# Altium schematic sheet main.SchDoc
size 594 x 420 mm
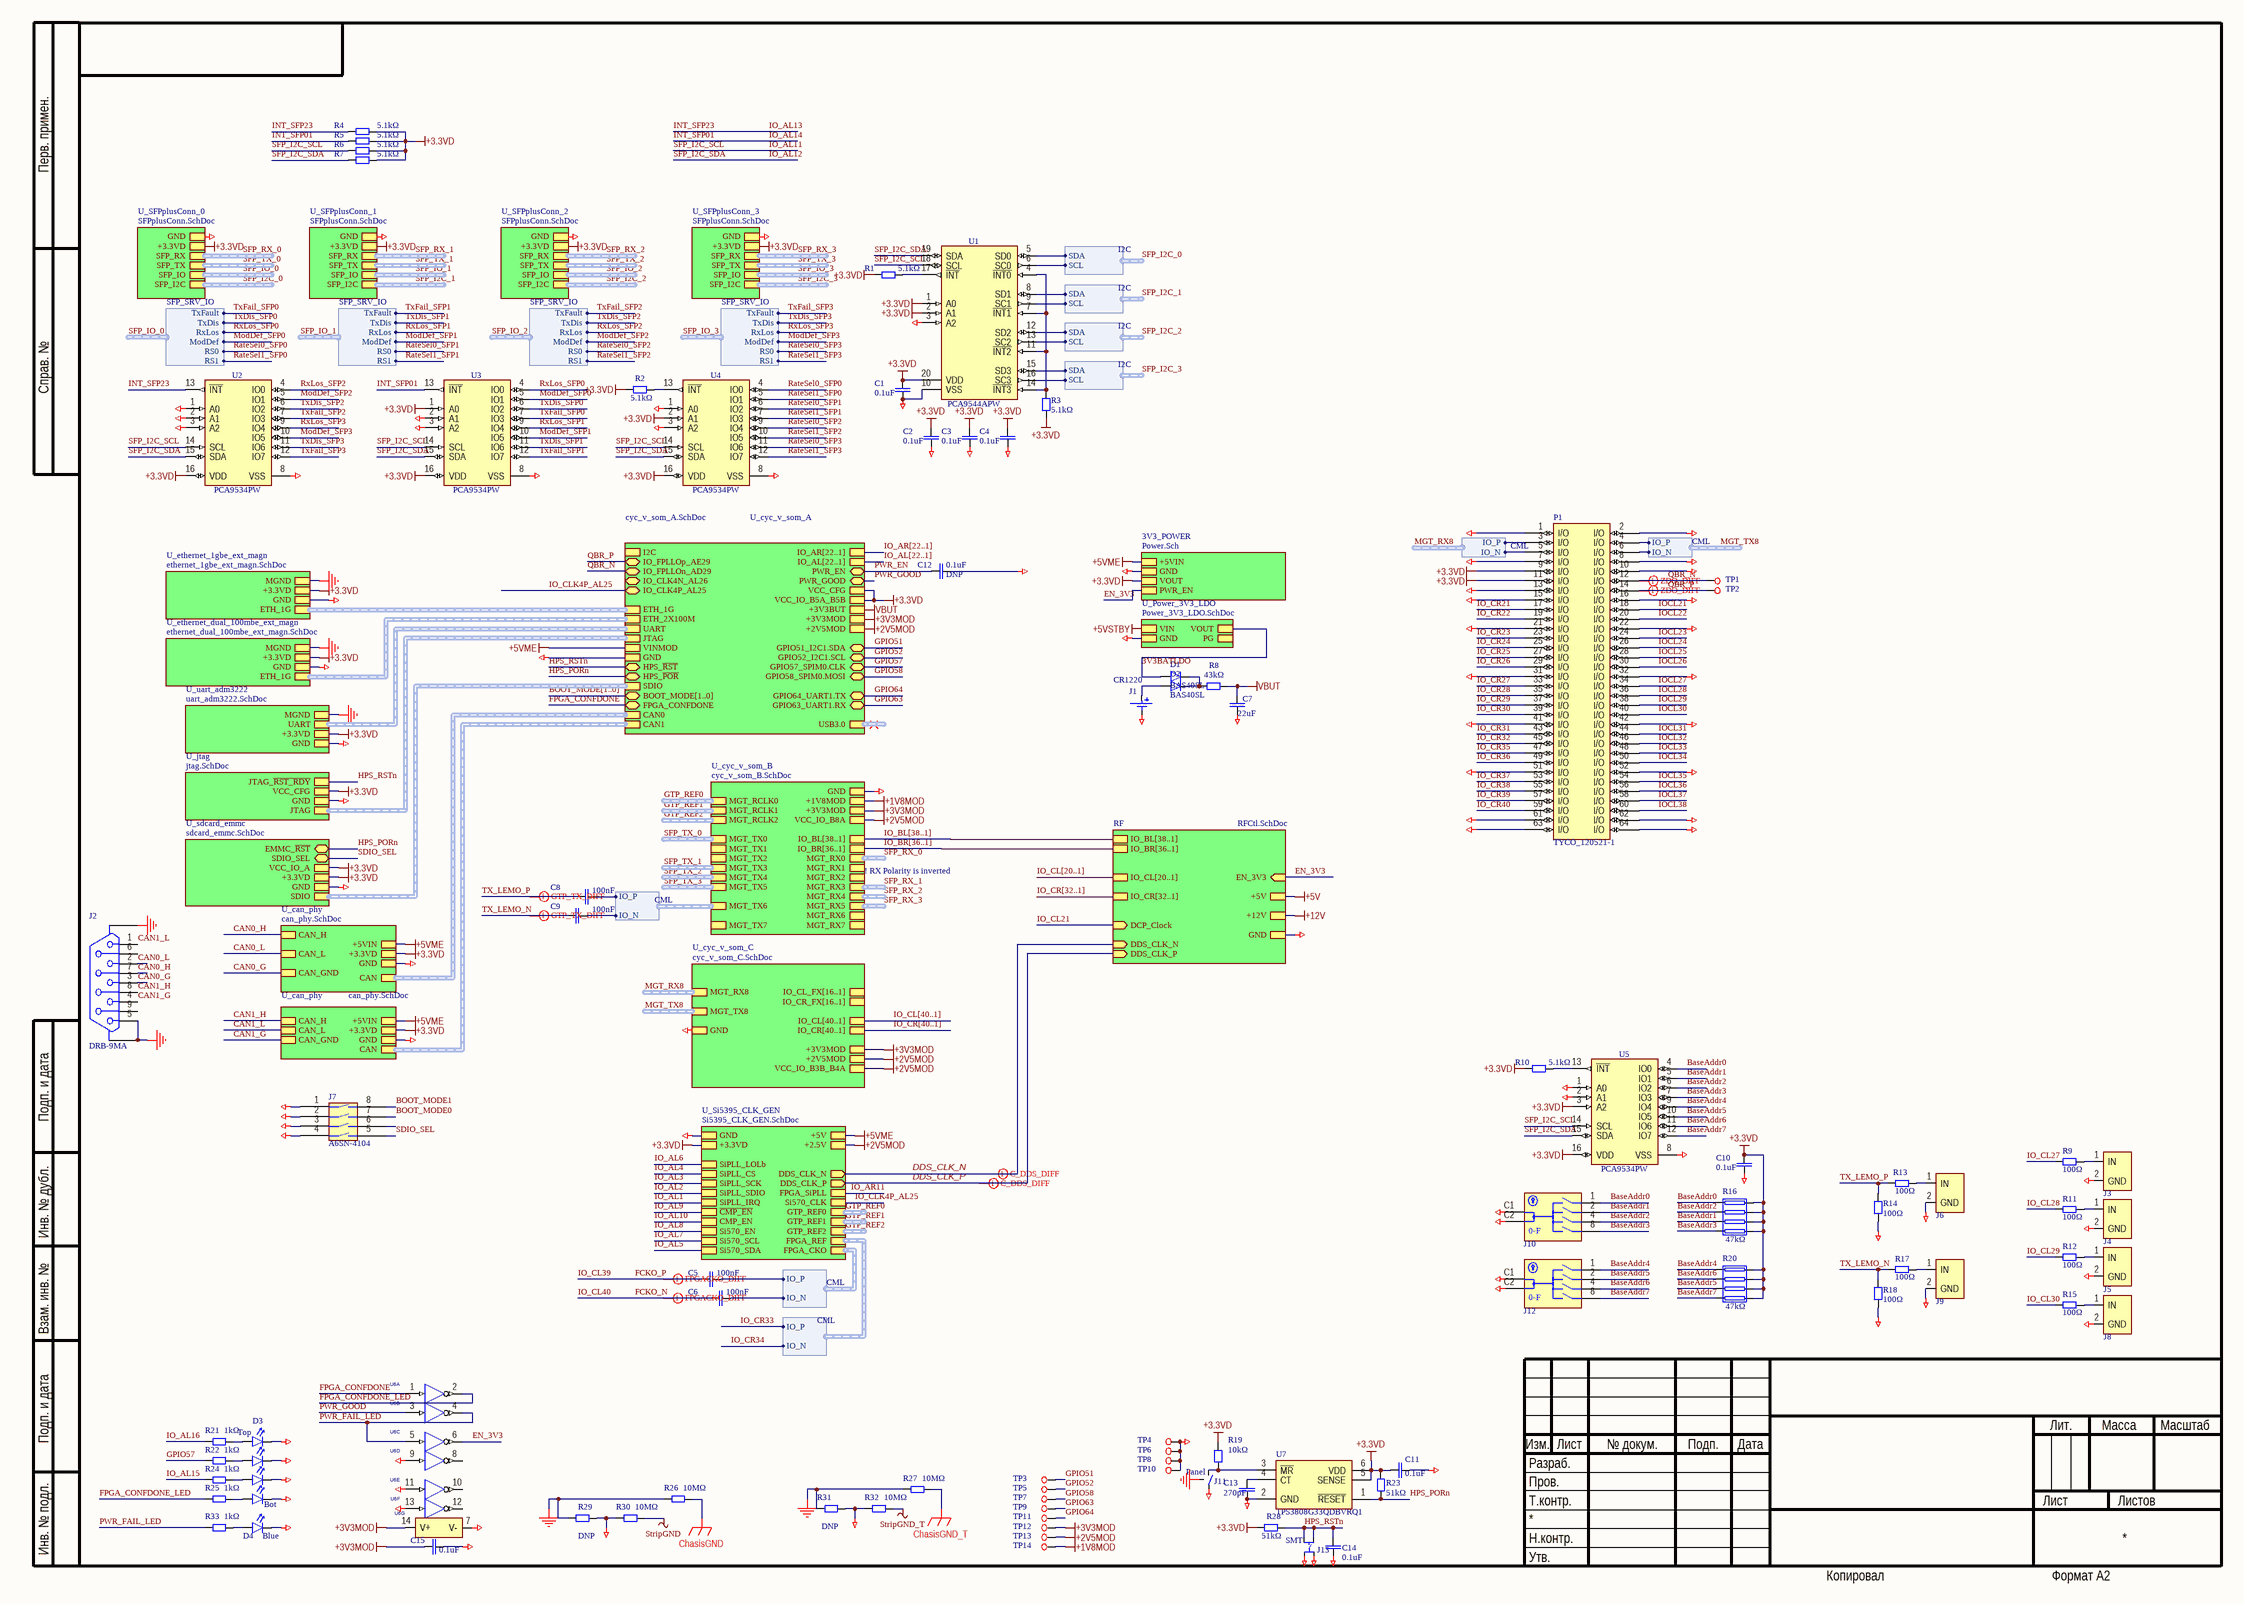
[diagram p0: main.SchDoc]

## Parts
C1  0.1uF  [CAPC2012N]
C2  0.1uF  [CAPC2012N]
C3  0.1uF  [CAPC2012N]
C4  0.1uF  [CAPC2012N]
C5  100nF  [CAPC1608N]
C6  100nF  [CAPC1608N]
C7  22uF  [CAPC2012N]
C8  100nF  [CAPC1608N]
C9  100nF  [CAPC1608N]
C10  0.1uF  [CAPC2012N]
C11  0.1uF  [CAPC2012N]
C12  PartField: 0.1uF  [CAPC2012N]  (hidden comment: DNP)
C13  270pF  [CAPC2012N]
C14  0.1uF  [CAPC2012N]
C15  0.1uF  [CAPC2012N]
D1  BAS40SL  [SOD_923]
D2  BAS40SL  [SOD_923]
D3  H485CGDL  [LED_H485C]  (value not drawn)
D4  Color: Blue  [LEDC1608N]  (hidden comment: LB Q39E-N1OO-35-1)
J1  BC501SM  [BAT_CR1220]  (value not drawn)
J2  DRB-9MA  [DRB-9MA]
J3  DNP  [LEMO_EPA.00.250.NTN]  (value not drawn)
J4  DNP  [LEMO_EPA.00.250.NTN]  (value not drawn)
J5  DNP  [LEMO_EPA.00.250.NTN]  (value not drawn)
J6  DNP  [LEMO_EPA.00.250.NTN]  (value not drawn)
J7  A6SN-4104  [DIPSW4-A6SN8]
J8  DNP  [LEMO_EPA.00.250.NTN]  (value not drawn)
J9  DNP  [LEMO_EPA.00.250.NTN]  (value not drawn)
J10  ERD116XSZ  [SW_ECE_ERD116XSZ]  (value not drawn)
J11  PTS645VL582LFS  [PTS645VL582LFS]  (value not drawn)
J12  ERD116XSZ  [SW_ECE_ERD116XSZ]  (value not drawn)
J13  PTS645SL43SMTR92  [PTS645SL43SMTR92]  (value not drawn)
P1  TYCO_120521-1  [TYCO_120521-1]
R1  5.1kΩ  [RESC2012N]
R2  5.1kΩ  [RESC2012N]
R3  5.1kΩ  [RESC2012N]
R4  5.1kΩ  [RESC2012N]
R5  5.1kΩ  [RESC2012N]
R6  5.1kΩ  [RESC2012N]
R7  5.1kΩ  [RESC2012N]
R8  43kΩ  [RESC2012N]
R9  100Ω  [RESC1608N]
R10  5.1kΩ  [RESC2012N]
R11  100Ω  [RESC1608N]
R12  100Ω  [RESC1608N]
R13  100Ω  [RESC1608N]
R14  100Ω  [RESC1608N]
R15  100Ω  [RESC1608N]
R16  value 47kΩ  [CAY16-J4]  (hidden comment: CAY16-4702F4LF)
R17  100Ω  [RESC1608N]
R18  100Ω  [RESC1608N]
R19  10kΩ  [RESC2012N]
R20  value 47kΩ  [CAY16-J4]  (hidden comment: CAY16-4702F4LF)
R21  1kΩ  [RESC2012N]
R22  1kΩ  [RESC2012N]
R23  51kΩ  [RESC2012N]
R24  1kΩ  [RESC2012N]
R25  1kΩ  [RESC2012N]
R26  10MΩ  [RESC2012N]
R27  10MΩ  [RESC2012N]
R28  51kΩ  [RESC2012N]
R29  DNP  [RESC2012N]
R30  10MΩ  [RESC2012N]
R31  DNP  [RESC2012N]
R32  10MΩ  [RESC2012N]
R33  1kΩ  [RESC2012N]
TP1  test point  [TEST_POINT]  (value not drawn)  (no BOM)
TP2  test point  [TEST_POINT]  (value not drawn)  (no BOM)
TP3  test point  [TEST_POINT]  (value not drawn)  (no BOM)
TP4  test point  [TEST_POINT]  (value not drawn)  (no BOM)
TP5  test point  [TEST_POINT]  (value not drawn)  (no BOM)
TP6  test point  [TEST_POINT]  (value not drawn)  (no BOM)
TP7  test point  [TEST_POINT]  (value not drawn)  (no BOM)
TP8  test point  [TEST_POINT]  (value not drawn)  (no BOM)
TP9  test point  [TEST_POINT]  (value not drawn)  (no BOM)
TP10  test point  [TEST_POINT]  (value not drawn)  (no BOM)
TP11  test point  [TEST_POINT]  (value not drawn)  (no BOM)
TP12  test point  [TEST_POINT]  (value not drawn)  (no BOM)
TP13  test point  [TEST_POINT]  (value not drawn)  (no BOM)
TP14  test point  [TEST_POINT]  (value not drawn)  (no BOM)
U1  PCA9544APW  [SOP65P640X110-20N]
U2  PCA9534PW  [SOP65P640X110-16N]
U3  PCA9534PW  [SOP65P640X110-16N]
U4  PCA9534PW  [SOP65P640X110-16N]
U5  PCA9534PW  [SOP65P640X110-16N]
U6  SN74LVC04APW  [SOP65P640X110-14N]  (value not drawn)  (parts A,B,C,D,E,F,G of 7)
U7  TPS3808G33QDBVRQ1  [SOT95P280X100-6N]

## Sub-sheets
3V3_POWER = Power.Sch: +5VIN, GND, VOUT, PWR_EN
RF = RFCtl.SchDoc: IO_BL[38..1], EN_3V3 (in), DDS_CLK_N (in), DDS_CLK_P (in), IO_CL[20..1], IO_CR[32..1], IO_BR[36..1], +5V, +12V, GND, DCP_Clock (in)
U_can_phy = can_phy.SchDoc: CAN (harness CAN), GND, +3.3VD, CAN_H, CAN_L, CAN_GND, +5VIN
U_can_phy = can_phy.SchDoc: CAN (harness CAN), GND, +3.3VD, CAN_H, CAN_L, CAN_GND, +5VIN
U_cyc_v_som_A = cyc_v_som_A.SchDoc: ETH_1G (harness EthLanes), ETH_2X100M (harness EthLanes), UART (harness UART), I2C (harness I2C), GND, VINMOD, HPS_~{RST} (bidir), HPS_~{POR} (bidir), SDIO (harness SDIO), BOOT_MODE[1..0] (bidir), FPGA_CONFDONE (bidir), CAN0 (harness CAN), CAN1 (harness CAN), IO_AR[22..1], +2V5MOD, +3V3MOD, GPIO52_I2C1.SCL (bidir), GPIO63_UART1.RX (bidir), GPIO51_I2C1.SDA (bidir), GPIO57_SPIM0.CLK (bidir), GPIO64_UART1.TX (bidir), USB3.0 (harness USB3), GPIO58_SPIM0.MOSI (bidir), +3V3BUT, IO_CLK4N_AL26 (bidir), IO_CLK4P_AL25 (bidir), PWR_EN (bidir), PWR_GOOD (bidir), VCC_IO_B5A_B5B, VCC_CFG, IO_FPLLOp_AE29 (bidir), IO_AL[22..1], IO_FPLLOn_AD29 (bidir), JTAG
U_cyc_v_som_B = cyc_v_som_B.SchDoc: GND, MGT_RCLK2 (harness CML), MGT_RCLK1 (harness CML), IO_BL[38..1], IO_BR[36..1], MGT_RCLK0 (harness CML), +1V8MOD, +3V3MOD, VCC_IO_B8A, MGT_TX5 (harness CML), MGT_TX3 (harness CML), MGT_TX6 (harness CML), MGT_TX7 (harness CML), MGT_TX2 (harness CML), MGT_TX1 (harness CML), MGT_TX4 (harness CML), MGT_TX0 (harness CML), MGT_RX0 (harness CML), MGT_RX1 (harness CML), MGT_RX6 (harness CML), MGT_RX4 (harness CML), MGT_RX5 (harness CML), MGT_RX3 (harness CML), MGT_RX2 (harness CML), MGT_RX7 (harness CML)
U_cyc_v_som_C = cyc_v_som_C.SchDoc: GND, MGT_TX8 (harness CML), IO_CL_FX[16..1], IO_CR_FX[16..1], MGT_RX8 (harness CML), IO_CL[40..1], IO_CR[40..1], +3V3MOD, +2V5MOD, VCC_IO_B3B_B4A
U_ethernet_1gbe_ext_magn = ethernet_1gbe_ext_magn.SchDoc: ETH_1G (harness EthLanes), GND, +3.3VD, MGND
U_ethernet_dual_100mbe_ext_magn = ethernet_dual_100mbe_ext_magn.SchDoc: ETH_1G (harness EthLanes), GND, +3.3VD, MGND
U_jtag = jtag.SchDoc: JTAG (harness JTAG), GND, VCC_CFG, JTAG_~{RST_RDY}
U_Power_3V3_LDO = Power_3V3_LDO.SchDoc: GND, VOUT, VIN, PG
U_sdcard_emmc = sdcard_emmc.SchDoc: SDIO (harness SDIO), GND, +3.3VD, VCC_IO_A, SDIO_SEL (bidir), EMMC_~{RST} (bidir)
U_SFPplusConn_0 = SFPplusConn.SchDoc: GND, +3.3VD, SFP_TX (harness CML), SFP_RX (harness CML), SFP_IO (harness SFP_SRV_IO), SFP_I2C (harness I2C)
U_SFPplusConn_1 = SFPplusConn.SchDoc: GND, +3.3VD, SFP_TX (harness CML), SFP_RX (harness CML), SFP_IO (harness SFP_SRV_IO), SFP_I2C (harness I2C)
U_SFPplusConn_2 = SFPplusConn.SchDoc: GND, +3.3VD, SFP_TX (harness CML), SFP_RX (harness CML), SFP_IO (harness SFP_SRV_IO), SFP_I2C (harness I2C)
U_SFPplusConn_3 = SFPplusConn.SchDoc: GND, +3.3VD, SFP_TX (harness CML), SFP_RX (harness CML), SFP_IO (harness SFP_SRV_IO), SFP_I2C (harness I2C)
U_Si5395_CLK_GEN = Si5395_CLK_GEN.SchDoc: GND, +3.3VD, +5V, Si570_CLK, Si570_SCL, Si570_SDA, Si570_EN, ~{CMP_EN}, CMP_EN, +2.5V, FPGA_SiPLL, GTP_REF1 (harness CML), GTP_REF0 (harness CML), GTP_REF2 (harness CML), FPGA_CKO (harness CML), SiPLL_IRQ, SiPLL_SDIO, SiPLL_SCK, SiPLL_CS, FPGA_REF (harness CML), SiPLL_LOLb, DDS_CLK_N (out), DDS_CLK_P (out)
U_uart_adm3222 = uart_adm3222.SchDoc: GND, +3.3VD, UART (harness UART), MGND

## Harnesses
I2C: SDA, SCL
SFP_SRV_IO: TxDis, TxFault, RS0, RS1, ModDef, RxLos
CML: IO_N, IO_P

## Nets
+1V8MOD: TP14.1 ; sheet U_cyc_v_som_B/+1V8MOD
+2V5MOD: TP13.1 ; sheet U_cyc_v_som_A/+2V5MOD, sheet U_cyc_v_som_B/VCC_IO_B8A, sheet U_cyc_v_som_C/+2V5MOD, sheet U_cyc_v_som_C/VCC_IO_B3B_B4A, sheet U_Si5395_CLK_GEN/+2.5V
+3.3VD: C1.1 C2.1 C3.1 C4.1 C10.1 C11.2 P1.9(I/O) P1.11(I/O) R1.1 R2.1 R3.2 R4.2 R5.2 R6.2 R7.2 R10.1 R16.5 R16.6 R16.7 R16.8 R19.1 R20.5 R20.6 R20.7 R20.8 R23.1 R28.1 U1.1(A0) U1.2(A1) U1.20(VDD) U2.16(VDD) U3.1(A0) U3.16(VDD) U4.2(A1) U4.16(VDD) U5.3(A2) U5.16(VDD) U7.5(SENSE) U7.6(VDD) ; sheet U_cyc_v_som_A/VCC_IO_B5A_B5B, sheet U_cyc_v_som_A/VCC_CFG, sheet U_ethernet_1gbe_ext_magn/+3.3VD, sheet U_ethernet_dual_100mbe_ext_magn/+3.3VD, sheet U_uart_adm3222/+3.3VD, sheet U_jtag/VCC_CFG, sheet U_sdcard_emmc/+3.3VD, sheet U_sdcard_emmc/VCC_IO_A, sheet 3V3_POWER/VOUT, sheet U_can_phy/+3.3VD, sheet U_can_phy/+3.3VD, sheet U_SFPplusConn_0/+3.3VD, sheet U_SFPplusConn_1/+3.3VD, sheet U_SFPplusConn_2/+3.3VD, sheet U_SFPplusConn_3/+3.3VD, sheet U_Si5395_CLK_GEN/+3.3VD
+3V3MOD: C15.2 TP12.1 U6.14(V+) ; sheet U_cyc_v_som_A/+3V3MOD, sheet U_cyc_v_som_B/+3V3MOD, sheet U_cyc_v_som_C/+3V3MOD
+5V: sheet RF/+5V
+5VME: sheet U_cyc_v_som_A/VINMOD, sheet 3V3_POWER/+5VIN, sheet U_can_phy/+5VIN, sheet U_can_phy/+5VIN, sheet U_Si5395_CLK_GEN/+5V
+5VSTBY: sheet U_Power_3V3_LDO/VIN
+12V: sheet RF/+12V
ChasisGND: R26.2
ChasisGND_T: R27.2
GND: C1.2 C2.2 C3.2 C4.2 C7.1 C10.2 C11.1 C12.1 C13.2 C14.2 C15.1 D3.2(C) D3.4(C) D3.6(C) D3.8(C) D4.1(C) J1.2(-) J3.2(GND) J4.2(GND) J5.2(GND) J6.2(GND) J7.1 J7.2 J7.3 J7.4 J8.2(GND) J9.2(GND) J10.C1(C) J10.C2(C) J11.2 J12.C1(C) J12.C2(C) J13.3 J13.4 P1.1(I/O) P1.2(I/O) P1.7(I/O) P1.8(I/O) P1.10(I/O) P1.13(I/O) P1.15(I/O) P1.16(I/O) P1.21(I/O) P1.22(I/O) P1.31(I/O) P1.32(I/O) P1.41(I/O) P1.42(I/O) P1.51(I/O) P1.52(I/O) P1.61(I/O) P1.62(I/O) P1.63(I/O) P1.64(I/O) R14.2 R18.2 R29.2 R30.1 R31.2 R32.1 TP4.1 TP6.1 TP8.1 TP10.1 U1.3(A2) U1.10(VSS) U2.1(A0) U2.2(A1) U2.3(A2) U2.8(VSS) U3.2(A1) U3.3(A2) U3.8(VSS) U4.1(A0) U4.3(A2) U4.8(VSS) U5.1(A0) U5.2(A1) U5.8(VSS) U6.7(V-) U6.9(A) U6.11(A) U6.13(A) U7.2(GND) ; sheet U_cyc_v_som_A/GND, sheet U_cyc_v_som_B/GND, sheet U_cyc_v_som_C/GND, sheet U_ethernet_1gbe_ext_magn/GND, sheet U_ethernet_dual_100mbe_ext_magn/GND, sheet U_uart_adm3222/GND, sheet U_jtag/GND, sheet U_sdcard_emmc/GND, sheet 3V3_POWER/GND, sheet U_can_phy/GND, sheet U_can_phy/GND, sheet U_Power_3V3_LDO/GND, sheet U_SFPplusConn_0/GND, sheet U_SFPplusConn_1/GND, sheet U_SFPplusConn_2/GND, sheet U_SFPplusConn_3/GND, sheet RF/GND, sheet U_Si5395_CLK_GEN/GND
MGND: J2.5 J2.S1(SHLD) J2.S2(SHLD) J11.0(S) R26.1 R27.1 R29.1 R31.1 ; sheet U_ethernet_1gbe_ext_magn/MGND, sheet U_ethernet_dual_100mbe_ext_magn/MGND, sheet U_uart_adm3222/MGND
StripGND: R30.2
StripGND_T: R32.2
VBUT: C7.2 R8.1 ; sheet U_cyc_v_som_A/+3V3BUT
3V3BATLDO: D1.1(A) ; sheet U_Power_3V3_LDO/VOUT
BaseAddr0: J10.1 R16.4 U5.4(IO0)
BaseAddr1: J10.2 R16.2 U5.5(IO1)
BaseAddr2: J10.4 R16.3 U5.6(IO2)
BaseAddr3: J10.8 R16.1 U5.7(IO3)
BaseAddr4: J12.1 R20.4 U5.9(IO4)
BaseAddr5: J12.2 R20.2 U5.10(IO5)
BaseAddr6: J12.4 R20.3 U5.11(IO6)
BaseAddr7: J12.8 R20.1 U5.12(IO7)
BOOT_MODE0: J7.7
BOOT_MODE1: J7.8
CAN0_G: J2.3 ; sheet U_can_phy/CAN_GND
CAN0_H: J2.7 ; sheet U_can_phy/CAN_H
CAN0_L: J2.2 ; sheet U_can_phy/CAN_L
CAN1_G: J2.4 ; sheet U_can_phy/CAN_GND
CAN1_H: J2.8 ; sheet U_can_phy/CAN_H
CAN1_L: J2.1 ; sheet U_can_phy/CAN_L
DDS_CLK_N: sheet RF/DDS_CLK_N, sheet U_Si5395_CLK_GEN/DDS_CLK_N
DDS_CLK_P: sheet RF/DDS_CLK_P, sheet U_Si5395_CLK_GEN/DDS_CLK_P
EN_3V3: U6.6(B) ; sheet 3V3_POWER/PWR_EN, sheet RF/EN_3V3
FCKO_N: C6.1  [also labelled IO_CL40]
FCKO_P: C5.1  [also labelled IO_CL39]
FPGA_CONFDONE: U6.1(A) ; sheet U_cyc_v_som_A/FPGA_CONFDONE
FPGA_CONFDONE_LED: R25.1 U6.2(B)
GPIO51: TP3.1 ; sheet U_cyc_v_som_A/GPIO51_I2C1.SDA
GPIO52: TP5.1 ; sheet U_cyc_v_som_A/GPIO52_I2C1.SCL
GPIO57: R22.1 ; sheet U_cyc_v_som_A/GPIO57_SPIM0.CLK
GPIO58: TP7.1 ; sheet U_cyc_v_som_A/GPIO58_SPIM0.MOSI
GPIO63: TP9.1 ; sheet U_cyc_v_som_A/GPIO63_UART1.RX
GPIO64: TP11.1 ; sheet U_cyc_v_som_A/GPIO64_UART1.TX
HPS_PORn: R23.2 U7.1(~{RESET}) ; sheet U_cyc_v_som_A/HPS_~{POR}, sheet U_sdcard_emmc/EMMC_~{RST}
HPS_RSTn: C14.1 J13.1 J13.2 R28.2 ; sheet U_cyc_v_som_A/HPS_~{RST}, sheet U_jtag/JTAG_~{RST_RDY}
INT_SFP01: R5.1 U3.13(~{INT})  [also labelled IO_AL14]
INT_SFP23: R4.1 U2.13(~{INT})  [also labelled IO_AL13]
IO_AL1: sheet U_Si5395_CLK_GEN/SiPLL_IRQ
IO_AL2: sheet U_Si5395_CLK_GEN/SiPLL_SDIO
IO_AL3: sheet U_Si5395_CLK_GEN/SiPLL_SCK
IO_AL4: sheet U_Si5395_CLK_GEN/SiPLL_CS
IO_AL5: sheet U_Si5395_CLK_GEN/Si570_SDA
IO_AL6: sheet U_Si5395_CLK_GEN/SiPLL_LOLb
IO_AL7: sheet U_Si5395_CLK_GEN/Si570_SCL
IO_AL8: sheet U_Si5395_CLK_GEN/Si570_EN
IO_AL9: sheet U_Si5395_CLK_GEN/~{CMP_EN}
IO_AL10: sheet U_Si5395_CLK_GEN/CMP_EN
IO_AL11: R6.1 U1.18(SCL) U2.14(SCL) U3.14(SCL) U4.14(SCL) U5.14(SCL)  [also labelled SFP_I2C_SCL]
IO_AL12: R7.1 U1.19(SDA) U2.15(SDA) U3.15(SDA) U4.15(SDA) U5.15(SDA)  [also labelled SFP_I2C_SDA]
IO_AL15: R24.1
IO_AL16: R21.1
IO_AR11: sheet U_Si5395_CLK_GEN/FPGA_SiPLL
IO_CL21: sheet RF/DCP_Clock
IO_CL27: R9.2
IO_CL28: R11.2
IO_CL29: R12.2
IO_CL30: R15.2
IO_CLK4P_AL25: sheet U_cyc_v_som_A/IO_CLK4P_AL25, sheet U_Si5395_CLK_GEN/Si570_CLK
IO_CR21: P1.17(I/O)
IO_CR22: P1.19(I/O)
IO_CR23: P1.23(I/O)
IO_CR24: P1.25(I/O)
IO_CR25: P1.27(I/O)
IO_CR26: P1.29(I/O)
IO_CR27: P1.33(I/O)
IO_CR28: P1.35(I/O)
IO_CR29: P1.37(I/O)
IO_CR30: P1.39(I/O)
IO_CR31: P1.43(I/O)
IO_CR32: P1.45(I/O)
IO_CR33: sheet U_Si5395_CLK_GEN/FPGA_REF.IO_P
IO_CR34: sheet U_Si5395_CLK_GEN/FPGA_REF.IO_N
IO_CR35: P1.47(I/O)
IO_CR36: P1.49(I/O)
IO_CR37: P1.53(I/O)
IO_CR38: P1.55(I/O)
IO_CR39: P1.57(I/O)
IO_CR40: P1.59(I/O)
IOCL21: P1.18(I/O)
IOCL22: P1.20(I/O)
IOCL23: P1.24(I/O)
IOCL24: P1.26(I/O)
IOCL25: P1.28(I/O)
IOCL26: P1.30(I/O)
IOCL27: P1.34(I/O)
IOCL28: P1.36(I/O)
IOCL29: P1.38(I/O)
IOCL30: P1.40(I/O)
IOCL31: P1.44(I/O)
IOCL32: P1.46(I/O)
IOCL33: P1.48(I/O)
IOCL34: P1.50(I/O)
IOCL35: P1.54(I/O)
IOCL36: P1.56(I/O)
IOCL37: P1.58(I/O)
IOCL38: P1.60(I/O)
MGT_RX8.IO_N: P1.5(I/O) ; sheet U_cyc_v_som_C/MGT_RX8.IO_N
MGT_RX8.IO_P: P1.3(I/O) ; sheet U_cyc_v_som_C/MGT_RX8.IO_P
MGT_TX8.IO_N: P1.6(I/O) ; sheet U_cyc_v_som_C/MGT_TX8.IO_N
MGT_TX8.IO_P: P1.4(I/O) ; sheet U_cyc_v_som_C/MGT_TX8.IO_P
ModDef_SFP0: U3.5(IO1) ; sheet U_SFPplusConn_0/SFP_IO.ModDef
ModDef_SFP1: U3.10(IO5) ; sheet U_SFPplusConn_1/SFP_IO.ModDef
ModDef_SFP2: U2.5(IO1) ; sheet U_SFPplusConn_2/SFP_IO.ModDef
ModDef_SFP3: U2.10(IO5) ; sheet U_SFPplusConn_3/SFP_IO.ModDef
PWR_EN: C12.2 ; sheet U_cyc_v_som_A/PWR_EN
PWR_FAIL_LED: R33.1 U6.4(B) U6.5(A)
PWR_GOOD: U6.3(A) ; sheet U_cyc_v_som_A/PWR_GOOD
QBR_N: P1.12(I/O) TP1.1 ; sheet U_cyc_v_som_A/IO_FPLLOn_AD29
QBR_P: P1.14(I/O) TP2.1 ; sheet U_cyc_v_som_A/IO_FPLLOp_AE29
RateSel0_SFP0: U4.4(IO0) ; sheet U_SFPplusConn_0/SFP_IO.RS0
RateSel0_SFP1: U4.6(IO2) ; sheet U_SFPplusConn_1/SFP_IO.RS0
RateSel0_SFP2: U4.9(IO4) ; sheet U_SFPplusConn_2/SFP_IO.RS0
RateSel0_SFP3: U4.11(IO6) ; sheet U_SFPplusConn_3/SFP_IO.RS0
RateSel1_SFP0: U4.5(IO1) ; sheet U_SFPplusConn_0/SFP_IO.RS1
RateSel1_SFP1: U4.7(IO3) ; sheet U_SFPplusConn_1/SFP_IO.RS1
RateSel1_SFP2: U4.10(IO5) ; sheet U_SFPplusConn_2/SFP_IO.RS1
RateSel1_SFP3: U4.12(IO7) ; sheet U_SFPplusConn_3/SFP_IO.RS1
RxLos_SFP0: U3.4(IO0) ; sheet U_SFPplusConn_0/SFP_IO.RxLos
RxLos_SFP1: U3.9(IO4) ; sheet U_SFPplusConn_1/SFP_IO.RxLos
RxLos_SFP2: U2.4(IO0) ; sheet U_SFPplusConn_2/SFP_IO.RxLos
RxLos_SFP3: U2.9(IO4) ; sheet U_SFPplusConn_3/SFP_IO.RxLos
SDIO_SEL: J7.5 ; sheet U_sdcard_emmc/SDIO_SEL
SFP_I2C_0.SCL: U1.6(SC0) ; sheet U_SFPplusConn_0/SFP_I2C.SCL
SFP_I2C_0.SDA: U1.5(SD0) ; sheet U_SFPplusConn_0/SFP_I2C.SDA
SFP_I2C_1.SCL: U1.9(SC1) ; sheet U_SFPplusConn_1/SFP_I2C.SCL
SFP_I2C_1.SDA: U1.8(SD1) ; sheet U_SFPplusConn_1/SFP_I2C.SDA
SFP_I2C_2.SCL: U1.13(SC2) ; sheet U_SFPplusConn_2/SFP_I2C.SCL
SFP_I2C_2.SDA: U1.12(SD2) ; sheet U_SFPplusConn_2/SFP_I2C.SDA
SFP_I2C_3.SCL: U1.16(SC3) ; sheet U_SFPplusConn_3/SFP_I2C.SCL
SFP_I2C_3.SDA: U1.15(SD3) ; sheet U_SFPplusConn_3/SFP_I2C.SDA
TX_LEMO_N: C9.1 R17.2 R18.1
TX_LEMO_P: C8.1 R13.2 R14.1
TxDis_SFP0: U3.6(IO2) ; sheet U_SFPplusConn_0/SFP_IO.TxDis  [project net SFP_IO_0.TxDis]
TxDis_SFP1: U3.11(IO6) ; sheet U_SFPplusConn_1/SFP_IO.TxDis  [project net SFP_IO_1.TxDis]
TxDis_SFP2: U2.6(IO2) ; sheet U_SFPplusConn_2/SFP_IO.TxDis  [project net SFP_IO_2.TxDis]
TxDis_SFP3: U2.11(IO6) ; sheet U_SFPplusConn_3/SFP_IO.TxDis  [project net SFP_IO_3.TxDis]
TxFail_SFP0: U3.7(IO3) ; sheet U_SFPplusConn_0/SFP_IO.TxFault  [project net SFP_IO_0.TxFault]
TxFail_SFP1: U3.12(IO7) ; sheet U_SFPplusConn_1/SFP_IO.TxFault  [project net SFP_IO_1.TxFault]
TxFail_SFP2: U2.7(IO3) ; sheet U_SFPplusConn_2/SFP_IO.TxFault  [project net SFP_IO_2.TxFault]
TxFail_SFP3: U2.12(IO7) ; sheet U_SFPplusConn_3/SFP_IO.TxFault  [project net SFP_IO_3.TxFault]
NetC5_2: C5.2 ; sheet U_Si5395_CLK_GEN/FPGA_CKO.IO_P
NetC6_2: C6.2 ; sheet U_Si5395_CLK_GEN/FPGA_CKO.IO_N
NetC8_2: C8.2 ; sheet U_cyc_v_som_B/MGT_TX6.IO_P
NetC9_2: C9.2 ; sheet U_cyc_v_som_B/MGT_TX6.IO_N
NetC13_1: C13.1 U7.4(CT)
NetD1_2: D1.2(C) D2.2(C) R8.2
NetD2_1: D2.1(A) J1.1(+)
NetD3_1: D3.1(A) R25.2
NetD3_3: D3.3(A) R24.2
NetD3_5: D3.5(A) R22.2
NetD3_7: D3.7(A) R21.2
NetD4_2: D4.2(A) R33.2
NetJ3_1: J3.1(IN) R9.1
NetJ4_1: J4.1(IN) R11.1
NetJ5_1: J5.1(IN) R12.1
NetJ6_1: J6.1(IN) R13.1
NetJ8_1: J8.1(IN) R15.1
NetJ9_1: J9.1(IN) R17.1
NetJ11_1: J11.1 R19.2 U7.3(~{MR})
NetR1_2: R1.2 U1.17(~{INT})
NetR2_2: R2.2 U4.13(~{INT})
NetR3_1: R3.1 U1.4(~{INT0}) U1.7(~{INT1}) U1.11(~{INT2}) U1.14(~{INT3})
NetR10_2: R10.2 U5.13(~{INT})

Not connected (* = marked no-connect by the designer): J2 6 9; J7 6; U6 8(B) 10(B) 12(B)

## Buses and harness runs
bus BOOT_MODE[1..0] = sheet U_cyc_v_som_A/BOOT_MODE[1..0]
bus IO_AL[22..1] = sheet U_cyc_v_som_A/IO_AL[22..1]
bus IO_AR[22..1] = sheet U_cyc_v_som_A/IO_AR[22..1]
bus IO_BL[38..1] = sheet RF/IO_BL[38..1] = sheet U_cyc_v_som_B/IO_BL[38..1]
bus IO_BR[36..1] = sheet RF/IO_BR[36..1] = sheet U_cyc_v_som_B/IO_BR[36..1]
bus IO_CL[20..1] = sheet RF/IO_CL[20..1]
bus IO_CL[40..1] = sheet U_cyc_v_som_C/IO_CL[40..1]
bus IO_CR[32..1] = sheet RF/IO_CR[32..1]
bus IO_CR[40..1] = sheet U_cyc_v_som_C/IO_CR[40..1]
harness GTP_REF0 = sheet U_cyc_v_som_B/MGT_RCLK0
harness GTP_REF0 = sheet U_Si5395_CLK_GEN/GTP_REF0
harness GTP_REF1 = sheet U_cyc_v_som_B/MGT_RCLK1
harness GTP_REF1 = sheet U_Si5395_CLK_GEN/GTP_REF1
harness GTP_REF2 = sheet U_cyc_v_som_B/MGT_RCLK2
harness GTP_REF2 = sheet U_Si5395_CLK_GEN/GTP_REF2
harness MGT_RX8 = sheet U_cyc_v_som_C/MGT_RX8
harness MGT_TX8 = sheet U_cyc_v_som_C/MGT_TX8
harness SFP_I2C_0 = sheet U_SFPplusConn_0/SFP_I2C
harness SFP_I2C_1 = sheet U_SFPplusConn_1/SFP_I2C
harness SFP_I2C_2 = sheet U_SFPplusConn_2/SFP_I2C
harness SFP_I2C_3 = sheet U_SFPplusConn_3/SFP_I2C
harness SFP_IO_0 = sheet U_SFPplusConn_0/SFP_IO
harness SFP_IO_1 = sheet U_SFPplusConn_1/SFP_IO
harness SFP_IO_2 = sheet U_SFPplusConn_2/SFP_IO
harness SFP_IO_3 = sheet U_SFPplusConn_3/SFP_IO
harness SFP_RX_0 = sheet U_cyc_v_som_B/MGT_RX0
harness SFP_RX_0 = sheet U_SFPplusConn_0/SFP_RX
harness SFP_RX_1 = sheet U_cyc_v_som_B/MGT_RX3
harness SFP_RX_1 = sheet U_SFPplusConn_1/SFP_RX
harness SFP_RX_2 = sheet U_cyc_v_som_B/MGT_RX4
harness SFP_RX_2 = sheet U_SFPplusConn_2/SFP_RX
harness SFP_RX_3 = sheet U_cyc_v_som_B/MGT_RX5
harness SFP_RX_3 = sheet U_SFPplusConn_3/SFP_RX
harness SFP_TX_0 = sheet U_cyc_v_som_B/MGT_TX0
harness SFP_TX_0 = sheet U_SFPplusConn_0/SFP_TX
harness SFP_TX_1 = sheet U_cyc_v_som_B/MGT_TX3
harness SFP_TX_1 = sheet U_SFPplusConn_1/SFP_TX
harness SFP_TX_2 = sheet U_cyc_v_som_B/MGT_TX4
harness SFP_TX_2 = sheet U_SFPplusConn_2/SFP_TX
harness SFP_TX_3 = sheet U_cyc_v_som_B/MGT_TX5
harness SFP_TX_3 = sheet U_SFPplusConn_3/SFP_TX
harness sheet U_can_phy/CAN = sheet U_cyc_v_som_A/CAN0
harness sheet U_can_phy/CAN = sheet U_cyc_v_som_A/CAN1
harness sheet U_cyc_v_som_A/ETH_1G = sheet U_ethernet_1gbe_ext_magn/ETH_1G
harness sheet U_cyc_v_som_A/ETH_2X100M = sheet U_ethernet_dual_100mbe_ext_magn/ETH_1G
harness sheet U_cyc_v_som_A/JTAG = sheet U_jtag/JTAG
harness sheet U_cyc_v_som_A/SDIO = sheet U_sdcard_emmc/SDIO
harness sheet U_cyc_v_som_A/UART = sheet U_uart_adm3222/UART

## Layout directives
differential pair; rule Differential Pairs Routing [Pref Gap = 0.175mm    Min Gap  = 0.075mm    Max Gap  = 0.5mmPref Width = 0.25mm    Min Width  = 0.075mm    Max Width  = 0.5mm]: DDS_CLK_N, DDS_CLK_P, FCKO_N, FCKO_P, TX_LEMO_N, TX_LEMO_P
differential pair; rule Differential Pairs Routing [Pref Gap = 0.175mm    Min Gap  = 0.075mm    Max Gap  = 0.5mmPref Width = 0.15mm    Min Width  = 0.075mm    Max Width  = 0.5mm]: QBR_N, QBR_P

## Notes on the sheet
- (near J1) CR1220
- ! RX Polarity is inverted
- Перв. примен.
- Справ. №
- Подп. и дата
- Инв. № дубл.
- Взам. инв. №
- Разраб.
- Изм.
- Лист
- № докум.
- Подп.
- Дата
- Лит.
- Масса
- Масштаб
- Пров.
- Т.контр.
- Листов
- Инв. № подл.
- Утв.
- Н.контр.
- Копировал
- Формат А2
- (in symbol ERD116XSZ) 0-F
- (in symbol LEDx4_H485CGDL) Top; Bot
- (in symbol PTS645SL43SMTR92) SMT
- (in symbol PTS645VL582LFS) Panel

## Library data of the parts
C1-C4 C7 C10-C15 = CAPC: Generic ceramic SMD capacitor; Pkg: 0805; Maintainer: Evgeniy Kotov; SMD Solders: 2; THD Solders: 0; Last Change Data: 06.03.2017; Release Date: 06.03.2017
  C1-C4 C10 C11 C14 C15: PartField: 0.1uF; Value: 0.1uF
  C7: PartField: 22uF; Value: 22uF
  C12: Value: DNP
  C13: PartField: 270pF; Value: 270pF
C5 C6 C8 C9 = CAPC: Generic ceramic SMD capacitor; Pkg: 0603; Maintainer: Evgeniy Kotov; SMD Solders: 2; THD Solders: 0; PartField: 100nF; Last Change Data: 06.03.2017; Release Date: 06.03.2017; Value: 100nF
D1 D2 = BAS40SL: Schottky Barrier Diode; Pkg: SOD-923F; Vendor: Vishay; Maintainer: Evgeniy Kotov; SMD Solders: 2; THD Solders: 0; Forward Current: 100mA; Reverse Voltage: 40V; Forward Voltage: 0.38V @ 1mA / 1V @ 40mA; Reverse Current: 15mA; PartField: BAS40SL; Release Date: 28.03.2017; Last Change Data: 28.03.2017; Temperature Range: -55°C to +150°C; Value: BAS40SL
D3 = LEDx4_H485CGDL: LED Circuit Board Indicator 4 High Green (x 4) Diffused 2.1V Round with Domed Top, 1.80mm Through Hole; Pkg: 8 pin THD Led; Vendor: Bivar Inc.; Maintainer: Evgeniy Kotov; SMD Solders: 0; THD Solders: 8; Forward Current: 5mA; PartField: H485CGDL; Release Date: 28.03.2017; Last Change Data: 28.03.2017; Temperature Range: -55°C to +150°C; Value: H485CGDL; Color: Green
D4 = LED_SMD0603: SMD Led, 0603; Pkg: 0603; Vendor: Vishay; Maintainer: Evgeniy Kotov; SMD Solders: 2; THD Solders: 0; Forward Current: 5mA; PartField: LB Q39E-N1OO-35-1; Release Date: 28.03.2017; Last Change Data: 28.03.2017; Temperature Range: -55°C to +150°C; Value: LB Q39E-N1OO-35-1
J1 = BAT_CR1220: BATTERY HOLDER COIN 12.5MM SMD; SMD Solders: 2; THD Solders: 0; Maintainer: Evgeniy Kotov; Pkg: 12MM SMD; PartField: BC501SM; Last Change Data: 02.04.2017; Release Date: 02.04.2017; Value: BC501SM; ComponentLink1Description: Datasheet
J2 = DRB-9MA: D-SUB; 9-pin, male, flange 7.2mm; SolderOption: 0; THD Solders: 11; PartField: DRB-9MA; Value: DRB-9MA; Pkg: DRB-9MA; SMD Solders: 0
J3-J6 J8 J9 = LEMO_EPA.00.250: PartField: EPA.00.250.NTN; SolderOption: 0; Pkg: LEMO 5pin; THD Solders: 5; Value: DNP; SMD Solders: 0
J7 = DIPSW4: SMD DIP Switch, Omron A6H or A6SN series; SMD Solders: 8; THD Solders: 0; Pkg: SMD 8pin; Value: A6SN-4104; Manufacturer: Omron; PartField: A6SN-4104
J10 J12 = ERD116XSZ: Vendor: ECE; SolderOption: 0; Pkg: Rotary 6pin; THD Solders: 6; Value: ERD116XSZ; PartField: ERD116XSZ; SMD Solders: 0
J11 = PTS645VL582LFS: Tactile Switch SPST-NO Side Actuated Through Hole, Right Angle; SMD Solders: 0; THD Solders: 4; Maintainer: Evgeniy Kotov; Pkg: Button 4 pin; PartField: PTS645VL582LFS; Last Change Data: 02.04.2017; Release Date: 02.04.2017; Value: PTS645VL582LFS; ComponentLink1Description: Datasheet
J13 = PTS645SL43SMTR92: Tactile Switch SPST-NO Top Actuated Surface Mount; SMD Solders: 4; THD Solders: 0; Maintainer: Evgeniy Kotov; Pkg: Button 4 pin; PartField: PTS645SL43SMTR92; Last Change Data: 02.04.2017; Release Date: 02.04.2017; Value: PTS645SL43SMTR92; ComponentLink1Description: Datasheet
P1 = PCI_PMC_TYCO_120521-1: PCI Mezzanine Connector; IEEE 1386; Manufacturer: TE Connectivity; Value: DNP; SMD Solders: 64; THD Solders: 0; Pkg: SMD 64 pin; PartField: TYCO_120521-1
R1-R8 R10 R19 R21-R28 R30 R32 R33 = RESC: Resistor, Generic, SMD; Pkg: 0805; Maintainer: Evgeniy Kotov; SMD Solders: 2; THD Solders: 0; Release Date: 06.03.2017; Last Change Data: 09.03.2017
  R1-R7 R10: PartField: 5.1kΩ; Value: 5.1kΩ
  R8: PartField: 43kΩ; Value: 43kΩ
  R19: PartField: 10kΩ; Value: 10kΩ
  R21 R22 R24 R25 R33: PartField: 1kΩ; Value: 1kΩ
  R23 R28: PartField: 51kΩ; Value: 51kΩ
  R26 R27 R30 R32: PartField: 10MΩ; Value: 10MΩ
R9 R11-R15 R17 R18 = RESC: Resistor, Generic, SMD; Pkg: 0603; Maintainer: Evgeniy Kotov; SMD Solders: 2; THD Solders: 0; PartField: 100Ω; Release Date: 06.03.2017; Last Change Data: 09.03.2017; Value: 100Ω
R16 R20 = RESPACK4: Maintainer: Anton Pavlenko; Pkg: SMD 8pin; SMD Solders: 8; THD Solders: 0; PartField: CAY16-4702F4LF; Last Change Data: 16.05.2019; Release Date: 16.05.2019
R29 R31 = RESC: Resistor, Generic, SMD; PartField: 0Ω; Pkg: 0805; Maintainer: Evgeniy Kotov; SMD Solders: 2; THD Solders: 0; Release Date: 06.03.2017; Last Change Data: 09.03.2017; Value: DNP
TP1-TP14 = TestPoint: Vendor: BINP; SolderOption: 0; Pkg: DNP; PartField: test point; Value: test point; SMD Solders: 0; THD Solders: 0
U1 = PCA9544APW: 4-Channel I2C-Bus Multiplexer with Interrupt Logic; Manufacturer: NXP SEMICONDUCTORS; PressFit: No; Bonding: No; Pkg: SSOP20; SMD Solders: 20; THD Solders: 0; Part Number: PCA9544APW; Component Kind: Standard; Component Type: Standard; Device: PCA9544APW; PackageDescription: SOP, 20-Leads, Body 6.6x4.5mm (max), Pitch 0.65mm, IPC Medium Density; Part Description: 4-Channel I2C-Bus Multiplexer with Interrupt Logic; Manufacturer Part Number: PCA9544APW; Pin Count: 20; Case: SSOP20; Mounted: Yes; Socket: No; SMD: Yes; ComponentHeight: 1.1mm; Author: CERN DEM JLC; HelpURL: \\cern.ch\dfs\Applications\Altium\Datasheets\PCA9544APW.pdf; CreateDate: 06/10/2014; LatestRevisionDate: 06/10/2014; Sense: No; Value: PCA9544APW; PartField: PCA9544APW
U2-U5 = PCA9534PW: 8-Bit I2C-Bus and SMBus Low Power I/O Port with Interrupt; Manufacturer: ANALOG DEVICES; PressFit: No; Bonding: No; Pkg: SSOP16; SMD Solders: 16; THD Solders: 0; Part Number: PCA9534PW; Component Kind: Standard; Component Type: Standard; Device: PCA9534PW; PackageDescription: SOP, 0.65mm pitch; 16 pin, 4.40mm W X 5.00mm L X 1.10mm H body IPC Medium Density; Part Description: 8-Bit I2C-Bus and SMBus Low Power I/O Port with Interrupt; Manufacturer Part Number: PCA9534PW; Pin Count: 16; Case: SSOP16; Mounted: Yes; Socket: No; SMD: Yes; ComponentHeight: 1.1mm; Author: CERN DEM JLC; HelpURL: \\cern.ch\dfs\Applications\Altium\Datasheets\PCA9534PW.pdf; CreateDate: 18/12/2013; LatestRevisionDate: 18/12/2013; Sense: No; Value: PCA9534PW; PartField: PCA9534PW
U6 = SN74LVC04APW: Sextuple NOR Gate; Manufacturer: Texas Instruments; INDUSTRY_STD_PKG_TYPE: TSSOP; FAMILY_NAME: NOR_GATE; PIN_COUNT: 14; PACKAGE_DESIGNATOR: PW; Pkg: PW-14; THD Solders: 0; Value: SN74LVC04APW; HelpURL: http://www.ti.com/lit/ds/symlink/sn74lvc04a.pdf; GENERIC_PART_NUMBER: SN74LVC04APW; Vendor: Texas Instruments; Manufacturer_Part_Number: SN74LVC04APW; SMD Solders: 14; PartField: SN74LVC04APW
U7 = TPS3808G33QDBVRQ1: Low-Quiescent-Current Programmable-Delay Supervisory Circuit; Pkg: SOT23-6; SMD Solders: 6; THD Solders: 0; Maintainer: Evgeniy Kotov; Vendor: Texas Instruments; PartField: TPS3808G33QDBVRQ1; ComponentLink1URL: http://www.ti.com/lit/ds/symlink/dac7565.pdf; ComponentLink1Description: Datasheet; Last Change Date: 19.03.2017; Release Date: 19.03.2017; Value: TPS3808G33QDBVRQ1